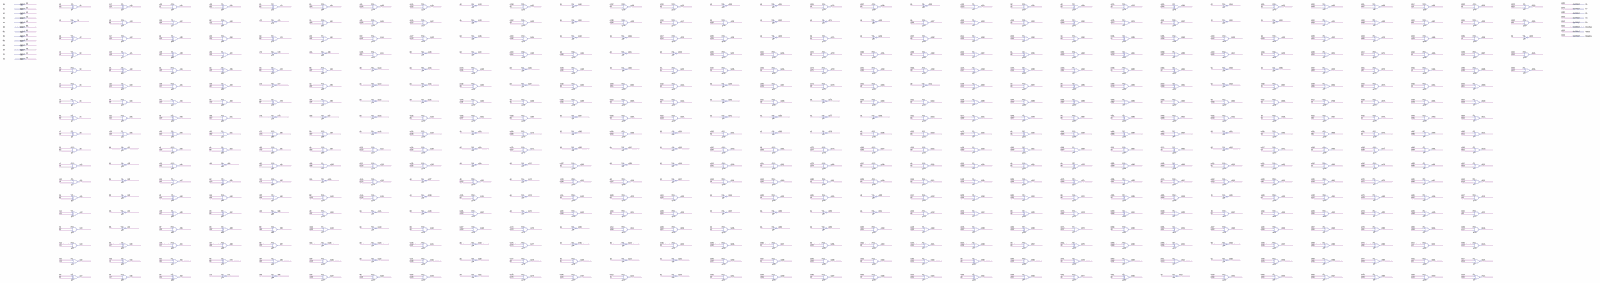
[diagram p0: schematic sheet, whole]
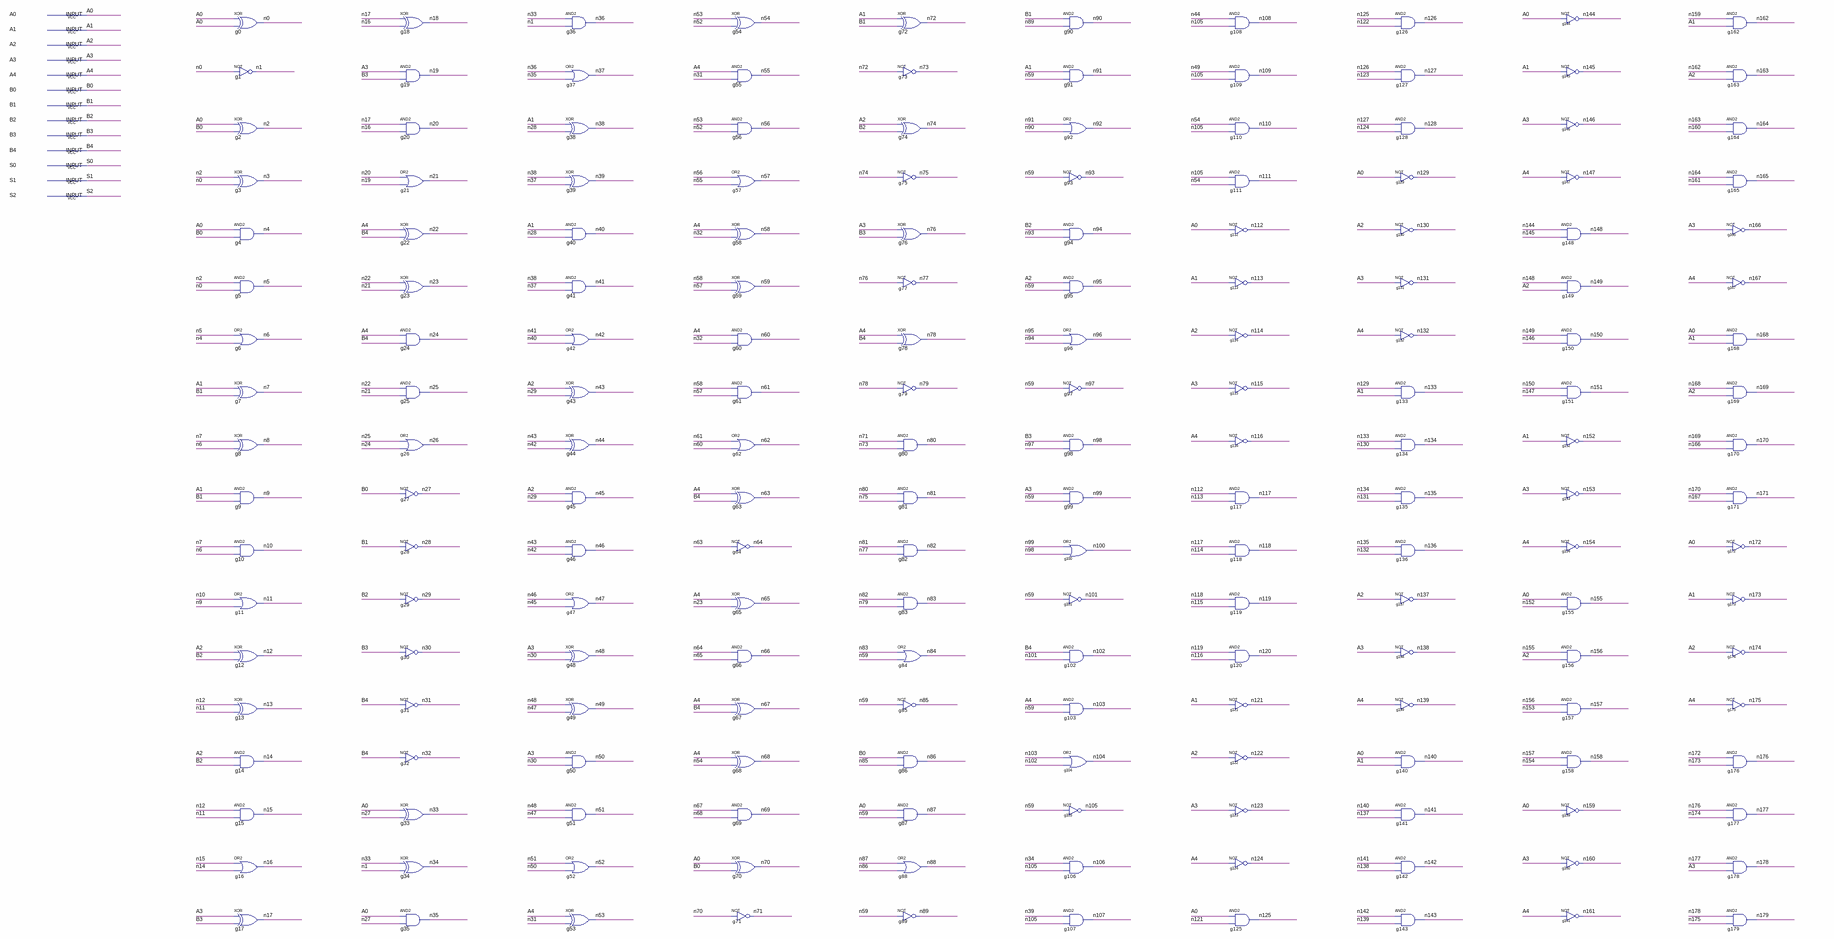
[diagram p1: schematic sheet, left part]
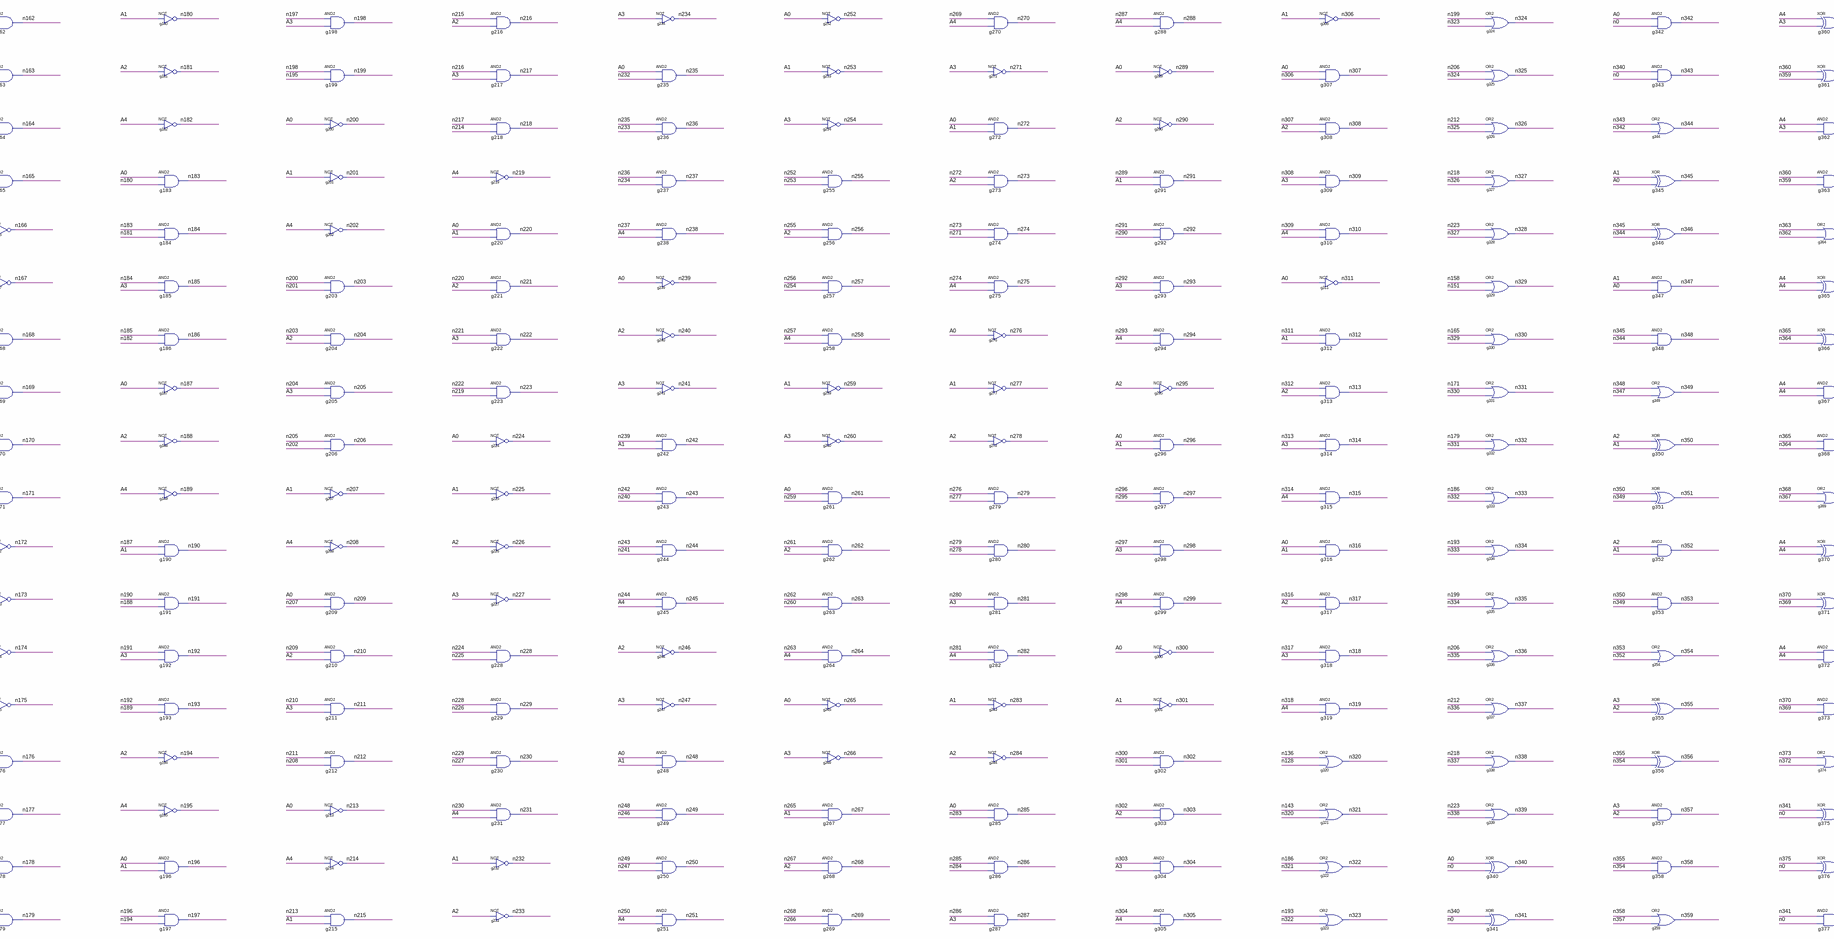
[diagram p2: schematic sheet, centre part]
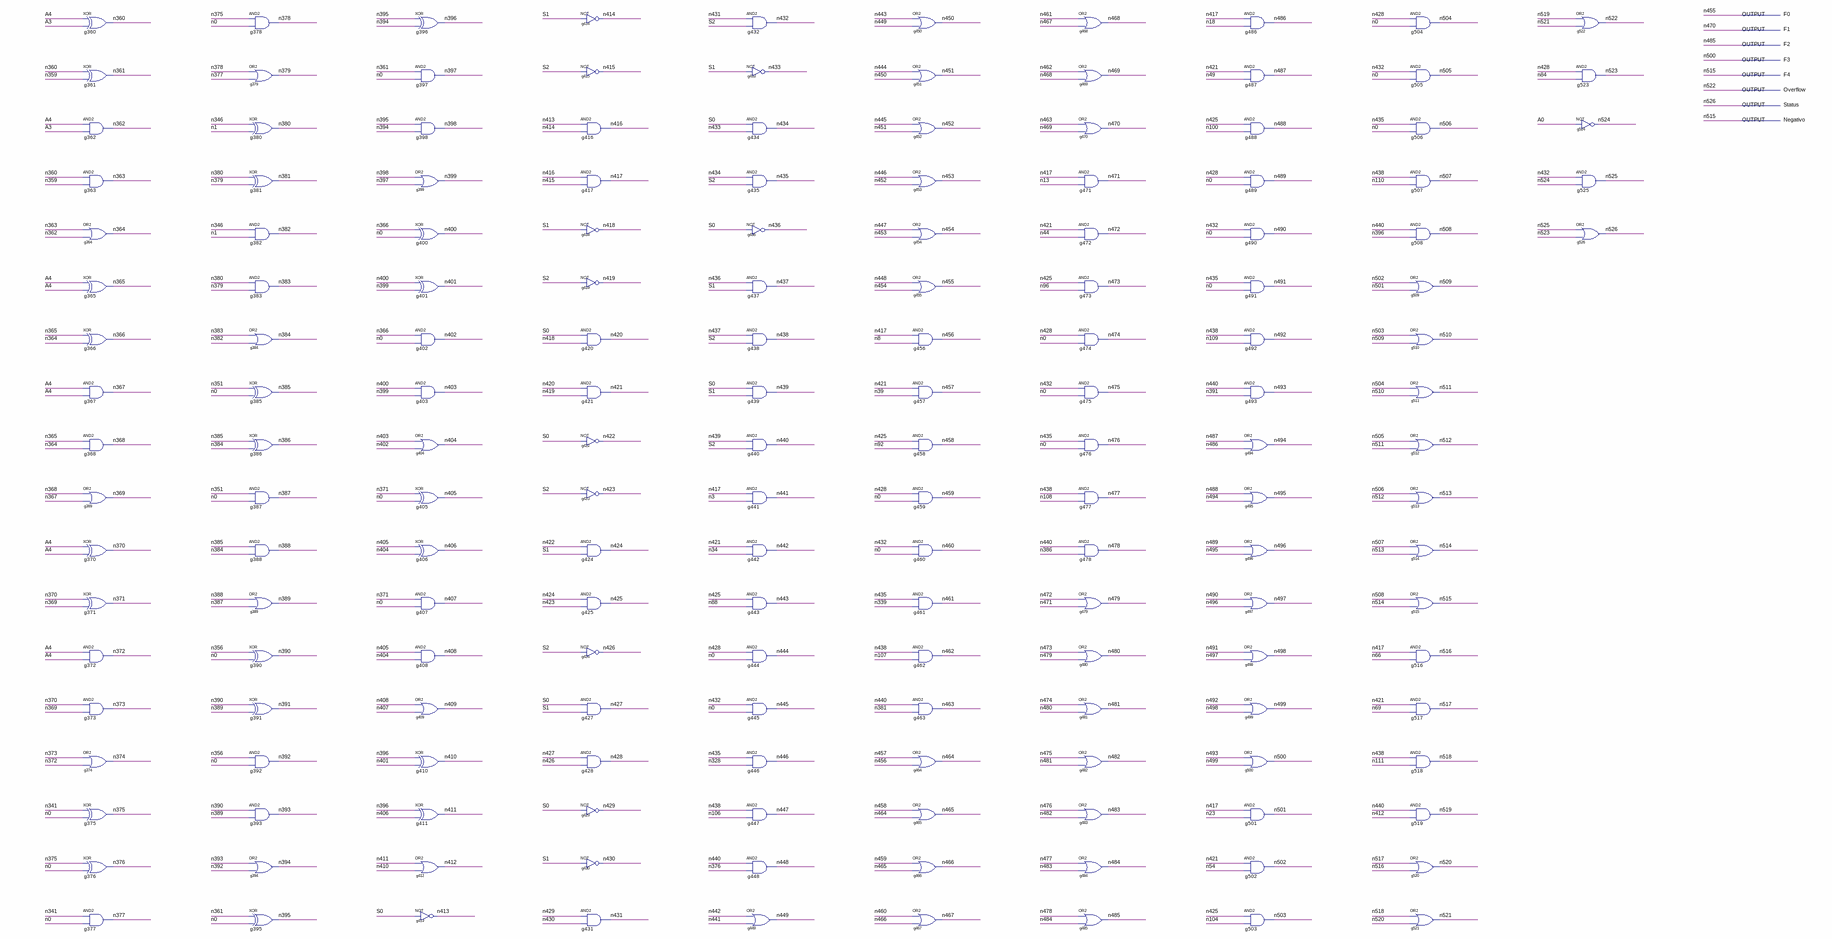
[diagram p3: schematic sheet, right part]
// Quartus schematic ula_core.bdf as structural Verilog: 527 symbols, 21 pins
module ula_core (
  input  A0,
  input  A1,
  input  A2,
  input  A3,
  input  A4,
  input  B0,
  input  B1,
  input  B2,
  input  B3,
  input  B4,
  input  S0,
  input  S1,
  input  S2,
  output F0,
  output F1,
  output F2,
  output F3,
  output F4,
  output Overflow,
  output Status,
  output Negativo
);

  wire n0, n1, n2, n3, n4, n5, n6, n7, n8, n9, n10, n11, n12, n13, n14, n15, n16, n17, n18, n19, n20, n21,
       n22, n23, n24, n25, n26, n27, n28, n29, n30, n31, n32, n33, n34, n35, n36, n37, n38, n39, n40, n41,
       n42, n43, n44, n45, n46, n47, n48, n49, n50, n51, n52, n53, n54, n55, n56, n57, n58, n59, n60, n61,
       n62, n63, n64, n65, n66, n67, n68, n69, n70, n71, n72, n73, n74, n75, n76, n77, n78, n79, n80, n81,
       n82, n83, n84, n85, n86, n87, n88, n89, n90, n91, n92, n93, n94, n95, n96, n97, n98, n99, n100, n101,
       n102, n103, n104, n105, n106, n107, n108, n109, n110, n111, n112, n113, n114, n115, n116, n117, n118,
       n119, n120, n121, n122, n123, n124, n125, n126, n127, n128, n129, n130, n131, n132, n133, n134, n135,
       n136, n137, n138, n139, n140, n141, n142, n143, n144, n145, n146, n147, n148, n149, n150, n151, n152,
       n153, n154, n155, n156, n157, n158, n159, n160, n161, n162, n163, n164, n165, n166, n167, n168, n169,
       n170, n171, n172, n173, n174, n175, n176, n177, n178, n179, n180, n181, n182, n183, n184, n185, n186,
       n187, n188, n189, n190, n191, n192, n193, n194, n195, n196, n197, n198, n199, n200, n201, n202, n203,
       n204, n205, n206, n207, n208, n209, n210, n211, n212, n213, n214, n215, n216, n217, n218, n219, n220,
       n221, n222, n223, n224, n225, n226, n227, n228, n229, n230, n231, n232, n233, n234, n235, n236, n237,
       n238, n239, n240, n241, n242, n243, n244, n245, n246, n247, n248, n249, n250, n251, n252, n253, n254,
       n255, n256, n257, n258, n259, n260, n261, n262, n263, n264, n265, n266, n267, n268, n269, n270, n271,
       n272, n273, n274, n275, n276, n277, n278, n279, n280, n281, n282, n283, n284, n285, n286, n287, n288,
       n289, n290, n291, n292, n293, n294, n295, n296, n297, n298, n299, n300, n301, n302, n303, n304, n305,
       n306, n307, n308, n309, n310, n311, n312, n313, n314, n315, n316, n317, n318, n319, n320, n321, n322,
       n323, n324, n325, n326, n327, n328, n329, n330, n331, n332, n333, n334, n335, n336, n337, n338, n339,
       n340, n341, n342, n343, n344, n345, n346, n347, n348, n349, n350, n351, n352, n353, n354, n355, n356,
       n357, n358, n359, n360, n361, n362, n363, n364, n365, n366, n367, n368, n369, n370, n371, n372, n373,
       n374, n375, n376, n377, n378, n379, n380, n381, n382, n383, n384, n385, n386, n387, n388, n389, n390,
       n391, n392, n393, n394, n395, n396, n397, n398, n399, n400, n401, n402, n403, n404, n405, n406, n407,
       n408, n409, n410, n411, n412, n413, n414, n415, n416, n417, n418, n419, n420, n421, n422, n423, n424,
       n425, n426, n427, n428, n429, n430, n431, n432, n433, n434, n435, n436, n437, n438, n439, n440, n441,
       n442, n443, n444, n445, n446, n447, n448, n449, n450, n451, n452, n453, n454, n456, n457, n458, n459,
       n460, n461, n462, n463, n464, n465, n466, n467, n468, n469, n471, n472, n473, n474, n475, n476, n477,
       n478, n479, n480, n481, n482, n483, n484, n486, n487, n488, n489, n490, n491, n492, n493, n494, n495,
       n496, n497, n498, n499, n501, n502, n503, n504, n505, n506, n507, n508, n509, n510, n511, n512, n513,
       n514, n516, n517, n518, n519, n520, n521, n523, n524, n525;

  xor g0 (n0, A0, A0);
  not g1 (n1, n0);
  xor g2 (n2, A0, B0);
  xor g3 (n3, n2, n0);
  and g4 (n4, A0, B0);
  and g5 (n5, n2, n0);
  or g6 (n6, n5, n4);
  xor g7 (n7, A1, B1);
  xor g8 (n8, n7, n6);
  and g9 (n9, A1, B1);
  and g10 (n10, n7, n6);
  or g11 (n11, n10, n9);
  xor g12 (n12, A2, B2);
  xor g13 (n13, n12, n11);
  and g14 (n14, A2, B2);
  and g15 (n15, n12, n11);
  or g16 (n16, n15, n14);
  xor g17 (n17, A3, B3);
  xor g18 (n18, n17, n16);
  and g19 (n19, A3, B3);
  and g20 (n20, n17, n16);
  or g21 (n21, n20, n19);
  xor g22 (n22, A4, B4);
  xor g23 (n23, n22, n21);
  and g24 (n24, A4, B4);
  and g25 (n25, n22, n21);
  or g26 (n26, n25, n24);
  not g27 (n27, B0);
  not g28 (n28, B1);
  not g29 (n29, B2);
  not g30 (n30, B3);
  not g31 (n31, B4);
  not g32 (n32, B4);
  xor g33 (n33, A0, n27);
  xor g34 (n34, n33, n1);
  and g35 (n35, A0, n27);
  and g36 (n36, n33, n1);
  or g37 (n37, n36, n35);
  xor g38 (n38, A1, n28);
  xor g39 (n39, n38, n37);
  and g40 (n40, A1, n28);
  and g41 (n41, n38, n37);
  or g42 (n42, n41, n40);
  xor g43 (n43, A2, n29);
  xor g44 (n44, n43, n42);
  and g45 (n45, A2, n29);
  and g46 (n46, n43, n42);
  or g47 (n47, n46, n45);
  xor g48 (n48, A3, n30);
  xor g49 (n49, n48, n47);
  and g50 (n50, A3, n30);
  and g51 (n51, n48, n47);
  or g52 (n52, n51, n50);
  xor g53 (n53, A4, n31);
  xor g54 (n54, n53, n52);
  and g55 (n55, A4, n31);
  and g56 (n56, n53, n52);
  or g57 (n57, n56, n55);
  xor g58 (n58, A4, n32);
  xor g59 (n59, n58, n57);
  and g60 (n60, A4, n32);
  and g61 (n61, n58, n57);
  or g62 (n62, n61, n60);
  xor g63 (n63, A4, B4);
  not g64 (n64, n63);
  xor g65 (n65, A4, n23);
  and g66 (n66, n64, n65);
  xor g67 (n67, A4, B4);
  xor g68 (n68, A4, n54);
  and g69 (n69, n67, n68);
  xor g70 (n70, A0, B0);
  not g71 (n71, n70);
  xor g72 (n72, A1, B1);
  not g73 (n73, n72);
  xor g74 (n74, A2, B2);
  not g75 (n75, n74);
  xor g76 (n76, A3, B3);
  not g77 (n77, n76);
  xor g78 (n78, A4, B4);
  not g79 (n79, n78);
  and g80 (n80, n71, n73);
  and g81 (n81, n80, n75);
  and g82 (n82, n81, n77);
  and g83 (n83, n82, n79);
  or g84 (n84, n83, n59);
  not g85 (n85, n59);
  and g86 (n86, B0, n85);
  and g87 (n87, A0, n59);
  or g88 (n88, n87, n86);
  not g89 (n89, n59);
  and g90 (n90, B1, n89);
  and g91 (n91, A1, n59);
  or g92 (n92, n91, n90);
  not g93 (n93, n59);
  and g94 (n94, B2, n93);
  and g95 (n95, A2, n59);
  or g96 (n96, n95, n94);
  not g97 (n97, n59);
  and g98 (n98, B3, n97);
  and g99 (n99, A3, n59);
  or g100 (n100, n99, n98);
  not g101 (n101, n59);
  and g102 (n102, B4, n101);
  and g103 (n103, A4, n59);
  or g104 (n104, n103, n102);
  not g105 (n105, n59);
  and g106 (n106, n34, n105);
  and g107 (n107, n39, n105);
  and g108 (n108, n44, n105);
  and g109 (n109, n49, n105);
  and g110 (n110, n54, n105);
  and g111 (n111, n105, n54);
  not g112 (n112, A0);
  not g113 (n113, A1);
  not g114 (n114, A2);
  not g115 (n115, A3);
  not g116 (n116, A4);
  and g117 (n117, n112, n113);
  and g118 (n118, n117, n114);
  and g119 (n119, n118, n115);
  and g120 (n120, n119, n116);
  not g121 (n121, A1);
  not g122 (n122, A2);
  not g123 (n123, A3);
  not g124 (n124, A4);
  and g125 (n125, A0, n121);
  and g126 (n126, n125, n122);
  and g127 (n127, n126, n123);
  and g128 (n128, n127, n124);
  not g129 (n129, A0);
  not g130 (n130, A2);
  not g131 (n131, A3);
  not g132 (n132, A4);
  and g133 (n133, n129, A1);
  and g134 (n134, n133, n130);
  and g135 (n135, n134, n131);
  and g136 (n136, n135, n132);
  not g137 (n137, A2);
  not g138 (n138, A3);
  not g139 (n139, A4);
  and g140 (n140, A0, A1);
  and g141 (n141, n140, n137);
  and g142 (n142, n141, n138);
  and g143 (n143, n142, n139);
  not g144 (n144, A0);
  not g145 (n145, A1);
  not g146 (n146, A3);
  not g147 (n147, A4);
  and g148 (n148, n144, n145);
  and g149 (n149, n148, A2);
  and g150 (n150, n149, n146);
  and g151 (n151, n150, n147);
  not g152 (n152, A1);
  not g153 (n153, A3);
  not g154 (n154, A4);
  and g155 (n155, A0, n152);
  and g156 (n156, n155, A2);
  and g157 (n157, n156, n153);
  and g158 (n158, n157, n154);
  not g159 (n159, A0);
  not g160 (n160, A3);
  not g161 (n161, A4);
  and g162 (n162, n159, A1);
  and g163 (n163, n162, A2);
  and g164 (n164, n163, n160);
  and g165 (n165, n164, n161);
  not g166 (n166, A3);
  not g167 (n167, A4);
  and g168 (n168, A0, A1);
  and g169 (n169, n168, A2);
  and g170 (n170, n169, n166);
  and g171 (n171, n170, n167);
  not g172 (n172, A0);
  not g173 (n173, A1);
  not g174 (n174, A2);
  not g175 (n175, A4);
  and g176 (n176, n172, n173);
  and g177 (n177, n176, n174);
  and g178 (n178, n177, A3);
  and g179 (n179, n178, n175);
  not g180 (n180, A1);
  not g181 (n181, A2);
  not g182 (n182, A4);
  and g183 (n183, A0, n180);
  and g184 (n184, n183, n181);
  and g185 (n185, n184, A3);
  and g186 (n186, n185, n182);
  not g187 (n187, A0);
  not g188 (n188, A2);
  not g189 (n189, A4);
  and g190 (n190, n187, A1);
  and g191 (n191, n190, n188);
  and g192 (n192, n191, A3);
  and g193 (n193, n192, n189);
  not g194 (n194, A2);
  not g195 (n195, A4);
  and g196 (n196, A0, A1);
  and g197 (n197, n196, n194);
  and g198 (n198, n197, A3);
  and g199 (n199, n198, n195);
  not g200 (n200, A0);
  not g201 (n201, A1);
  not g202 (n202, A4);
  and g203 (n203, n200, n201);
  and g204 (n204, n203, A2);
  and g205 (n205, n204, A3);
  and g206 (n206, n205, n202);
  not g207 (n207, A1);
  not g208 (n208, A4);
  and g209 (n209, A0, n207);
  and g210 (n210, n209, A2);
  and g211 (n211, n210, A3);
  and g212 (n212, n211, n208);
  not g213 (n213, A0);
  not g214 (n214, A4);
  and g215 (n215, n213, A1);
  and g216 (n216, n215, A2);
  and g217 (n217, n216, A3);
  and g218 (n218, n217, n214);
  not g219 (n219, A4);
  and g220 (n220, A0, A1);
  and g221 (n221, n220, A2);
  and g222 (n222, n221, A3);
  and g223 (n223, n222, n219);
  not g224 (n224, A0);
  not g225 (n225, A1);
  not g226 (n226, A2);
  not g227 (n227, A3);
  and g228 (n228, n224, n225);
  and g229 (n229, n228, n226);
  and g230 (n230, n229, n227);
  and g231 (n231, n230, A4);
  not g232 (n232, A1);
  not g233 (n233, A2);
  not g234 (n234, A3);
  and g235 (n235, A0, n232);
  and g236 (n236, n235, n233);
  and g237 (n237, n236, n234);
  and g238 (n238, n237, A4);
  not g239 (n239, A0);
  not g240 (n240, A2);
  not g241 (n241, A3);
  and g242 (n242, n239, A1);
  and g243 (n243, n242, n240);
  and g244 (n244, n243, n241);
  and g245 (n245, n244, A4);
  not g246 (n246, A2);
  not g247 (n247, A3);
  and g248 (n248, A0, A1);
  and g249 (n249, n248, n246);
  and g250 (n250, n249, n247);
  and g251 (n251, n250, A4);
  not g252 (n252, A0);
  not g253 (n253, A1);
  not g254 (n254, A3);
  and g255 (n255, n252, n253);
  and g256 (n256, n255, A2);
  and g257 (n257, n256, n254);
  and g258 (n258, n257, A4);
  not g259 (n259, A1);
  not g260 (n260, A3);
  and g261 (n261, A0, n259);
  and g262 (n262, n261, A2);
  and g263 (n263, n262, n260);
  and g264 (n264, n263, A4);
  not g265 (n265, A0);
  not g266 (n266, A3);
  and g267 (n267, n265, A1);
  and g268 (n268, n267, A2);
  and g269 (n269, n268, n266);
  and g270 (n270, n269, A4);
  not g271 (n271, A3);
  and g272 (n272, A0, A1);
  and g273 (n273, n272, A2);
  and g274 (n274, n273, n271);
  and g275 (n275, n274, A4);
  not g276 (n276, A0);
  not g277 (n277, A1);
  not g278 (n278, A2);
  and g279 (n279, n276, n277);
  and g280 (n280, n279, n278);
  and g281 (n281, n280, A3);
  and g282 (n282, n281, A4);
  not g283 (n283, A1);
  not g284 (n284, A2);
  and g285 (n285, A0, n283);
  and g286 (n286, n285, n284);
  and g287 (n287, n286, A3);
  and g288 (n288, n287, A4);
  not g289 (n289, A0);
  not g290 (n290, A2);
  and g291 (n291, n289, A1);
  and g292 (n292, n291, n290);
  and g293 (n293, n292, A3);
  and g294 (n294, n293, A4);
  not g295 (n295, A2);
  and g296 (n296, A0, A1);
  and g297 (n297, n296, n295);
  and g298 (n298, n297, A3);
  and g299 (n299, n298, A4);
  not g300 (n300, A0);
  not g301 (n301, A1);
  and g302 (n302, n300, n301);
  and g303 (n303, n302, A2);
  and g304 (n304, n303, A3);
  and g305 (n305, n304, A4);
  not g306 (n306, A1);
  and g307 (n307, A0, n306);
  and g308 (n308, n307, A2);
  and g309 (n309, n308, A3);
  and g310 (n310, n309, A4);
  not g311 (n311, A0);
  and g312 (n312, n311, A1);
  and g313 (n313, n312, A2);
  and g314 (n314, n313, A3);
  and g315 (n315, n314, A4);
  and g316 (n316, A0, A1);
  and g317 (n317, n316, A2);
  and g318 (n318, n317, A3);
  and g319 (n319, n318, A4);
  or g320 (n320, n136, n128);
  or g321 (n321, n143, n320);
  or g322 (n322, n186, n321);
  or g323 (n323, n193, n322);
  or g324 (n324, n199, n323);
  or g325 (n325, n206, n324);
  or g326 (n326, n212, n325);
  or g327 (n327, n218, n326);
  or g328 (n328, n223, n327);
  or g329 (n329, n158, n151);
  or g330 (n330, n165, n329);
  or g331 (n331, n171, n330);
  or g332 (n332, n179, n331);
  or g333 (n333, n186, n332);
  or g334 (n334, n193, n333);
  or g335 (n335, n199, n334);
  or g336 (n336, n206, n335);
  or g337 (n337, n212, n336);
  or g338 (n338, n218, n337);
  or g339 (n339, n223, n338);
  xor g340 (n340, A0, n0);
  xor g341 (n341, n340, n0);
  and g342 (n342, A0, n0);
  and g343 (n343, n340, n0);
  or g344 (n344, n343, n342);
  xor g345 (n345, A1, A0);
  xor g346 (n346, n345, n344);
  and g347 (n347, A1, A0);
  and g348 (n348, n345, n344);
  or g349 (n349, n348, n347);
  xor g350 (n350, A2, A1);
  xor g351 (n351, n350, n349);
  and g352 (n352, A2, A1);
  and g353 (n353, n350, n349);
  or g354 (n354, n353, n352);
  xor g355 (n355, A3, A2);
  xor g356 (n356, n355, n354);
  and g357 (n357, A3, A2);
  and g358 (n358, n355, n354);
  or g359 (n359, n358, n357);
  xor g360 (n360, A4, A3);
  xor g361 (n361, n360, n359);
  and g362 (n362, A4, A3);
  and g363 (n363, n360, n359);
  or g364 (n364, n363, n362);
  xor g365 (n365, A4, A4);
  xor g366 (n366, n365, n364);
  and g367 (n367, A4, A4);
  and g368 (n368, n365, n364);
  or g369 (n369, n368, n367);
  xor g370 (n370, A4, A4);
  xor g371 (n371, n370, n369);
  and g372 (n372, A4, A4);
  and g373 (n373, n370, n369);
  or g374 (n374, n373, n372);
  xor g375 (n375, n341, n0);
  xor g376 (n376, n375, n0);
  and g377 (n377, n341, n0);
  and g378 (n378, n375, n0);
  or g379 (n379, n378, n377);
  xor g380 (n380, n346, n1);
  xor g381 (n381, n380, n379);
  and g382 (n382, n346, n1);
  and g383 (n383, n380, n379);
  or g384 (n384, n383, n382);
  xor g385 (n385, n351, n0);
  xor g386 (n386, n385, n384);
  and g387 (n387, n351, n0);
  and g388 (n388, n385, n384);
  or g389 (n389, n388, n387);
  xor g390 (n390, n356, n0);
  xor g391 (n391, n390, n389);
  and g392 (n392, n356, n0);
  and g393 (n393, n390, n389);
  or g394 (n394, n393, n392);
  xor g395 (n395, n361, n0);
  xor g396 (n396, n395, n394);
  and g397 (n397, n361, n0);
  and g398 (n398, n395, n394);
  or g399 (n399, n398, n397);
  xor g400 (n400, n366, n0);
  xor g401 (n401, n400, n399);
  and g402 (n402, n366, n0);
  and g403 (n403, n400, n399);
  or g404 (n404, n403, n402);
  xor g405 (n405, n371, n0);
  xor g406 (n406, n405, n404);
  and g407 (n407, n371, n0);
  and g408 (n408, n405, n404);
  or g409 (n409, n408, n407);
  xor g410 (n410, n396, n401);
  xor g411 (n411, n396, n406);
  or g412 (n412, n411, n410);
  not g413 (n413, S0);
  not g414 (n414, S1);
  not g415 (n415, S2);
  and g416 (n416, n413, n414);
  and g417 (n417, n416, n415);
  not g418 (n418, S1);
  not g419 (n419, S2);
  and g420 (n420, S0, n418);
  and g421 (n421, n420, n419);
  not g422 (n422, S0);
  not g423 (n423, S2);
  and g424 (n424, n422, S1);
  and g425 (n425, n424, n423);
  not g426 (n426, S2);
  and g427 (n427, S0, S1);
  and g428 (n428, n427, n426);
  not g429 (n429, S0);
  not g430 (n430, S1);
  and g431 (n431, n429, n430);
  and g432 (n432, n431, S2);
  not g433 (n433, S1);
  and g434 (n434, S0, n433);
  and g435 (n435, n434, S2);
  not g436 (n436, S0);
  and g437 (n437, n436, S1);
  and g438 (n438, n437, S2);
  and g439 (n439, S0, S1);
  and g440 (n440, n439, S2);
  and g441 (n441, n417, n3);
  and g442 (n442, n421, n34);
  and g443 (n443, n425, n88);
  and g444 (n444, n428, n0);
  and g445 (n445, n432, n0);
  and g446 (n446, n435, n328);
  and g447 (n447, n438, n106);
  and g448 (n448, n440, n376);
  or g449 (n449, n442, n441);
  or g450 (n450, n443, n449);
  or g451 (n451, n444, n450);
  or g452 (n452, n445, n451);
  or g453 (n453, n446, n452);
  or g454 (n454, n447, n453);
  or g455 (F0, n448, n454);
  and g456 (n456, n417, n8);
  and g457 (n457, n421, n39);
  and g458 (n458, n425, n92);
  and g459 (n459, n428, n0);
  and g460 (n460, n432, n0);
  and g461 (n461, n435, n339);
  and g462 (n462, n438, n107);
  and g463 (n463, n440, n381);
  or g464 (n464, n457, n456);
  or g465 (n465, n458, n464);
  or g466 (n466, n459, n465);
  or g467 (n467, n460, n466);
  or g468 (n468, n461, n467);
  or g469 (n469, n462, n468);
  or g470 (F1, n463, n469);
  and g471 (n471, n417, n13);
  and g472 (n472, n421, n44);
  and g473 (n473, n425, n96);
  and g474 (n474, n428, n0);
  and g475 (n475, n432, n0);
  and g476 (n476, n435, n0);
  and g477 (n477, n438, n108);
  and g478 (n478, n440, n386);
  or g479 (n479, n472, n471);
  or g480 (n480, n473, n479);
  or g481 (n481, n474, n480);
  or g482 (n482, n475, n481);
  or g483 (n483, n476, n482);
  or g484 (n484, n477, n483);
  or g485 (F2, n478, n484);
  and g486 (n486, n417, n18);
  and g487 (n487, n421, n49);
  and g488 (n488, n425, n100);
  and g489 (n489, n428, n0);
  and g490 (n490, n432, n0);
  and g491 (n491, n435, n0);
  and g492 (n492, n438, n109);
  and g493 (n493, n440, n391);
  or g494 (n494, n487, n486);
  or g495 (n495, n488, n494);
  or g496 (n496, n489, n495);
  or g497 (n497, n490, n496);
  or g498 (n498, n491, n497);
  or g499 (n499, n492, n498);
  or g500 (F3, n493, n499);
  and g501 (n501, n417, n23);
  and g502 (n502, n421, n54);
  and g503 (n503, n425, n104);
  and g504 (n504, n428, n0);
  and g505 (n505, n432, n0);
  and g506 (n506, n435, n0);
  and g507 (n507, n438, n110);
  and g508 (n508, n440, n396);
  or g509 (n509, n502, n501);
  or g510 (n510, n503, n509);
  or g511 (n511, n504, n510);
  or g512 (n512, n505, n511);
  or g513 (n513, n506, n512);
  or g514 (n514, n507, n513);
  or g515 (F4, n508, n514);
  and g516 (n516, n417, n66);
  and g517 (n517, n421, n69);
  and g518 (n518, n438, n111);
  and g519 (n519, n440, n412);
  or g520 (n520, n517, n516);
  or g521 (n521, n518, n520);
  or g522 (Overflow, n519, n521);
  and g523 (n523, n428, n84);
  not g524 (n524, A0);
  and g525 (n525, n432, n524);
  or g526 (Status, n525, n523);

  assign Negativo = F4;

  // Other names for the same wires on the sheet: n455 = F0; n470 = F1; n485 = F2; n500 = F3; n515 = F4;
  //   n522 = Overflow; n526 = Status
endmodule
